# Altium schematic sheet SwitchIntegration.SchDoc
size A4; SheetNumber: 5; SheetTotal: 6
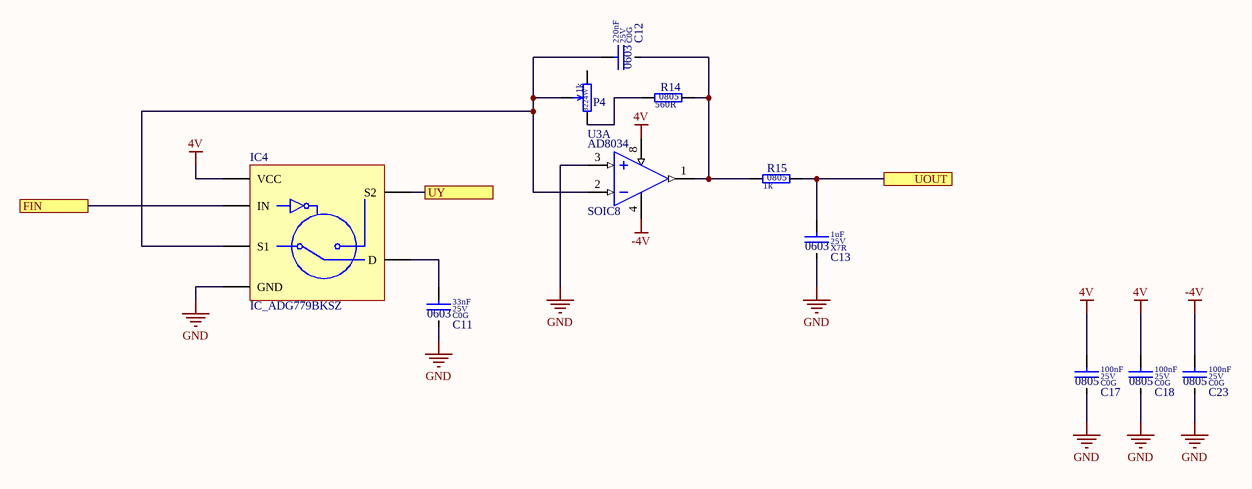
[diagram p0: SwitchIntegration.SchDoc]

## Parts
C11  value 33nF  Dielectric: C0G  Voltage: 25V  SCH_Footprint: 0603  [C_0603_1608]  (hidden comment: C_33nF_0603_C0G_25V_5)
C12  value 220nF  Dielectric: C0G  Voltage: 25V  SCH_Footprint: 0603  [C_0603_1608]  (hidden comment: C_220nF_0603_C0G_25V_5)
C13  value 1uF  Dielectric: X7R  Voltage: 25V  SCH_Footprint: 0603  [C_1206_3216]  (hidden comment: C_1uF_1206_X7R_25V_5)
C17  value 100nF  Dielectric: C0G  Voltage: 25V  SCH_Footprint: 0805  [C_0805_2012]  (hidden comment: C_100nF_0805_C0G_25V_5)
C18  value 100nF  Dielectric: C0G  Voltage: 25V  SCH_Footprint: 0805  [C_0805_2012]  (hidden comment: C_100nF_0805_C0G_25V_5)
C23  value 100nF  Dielectric: C0G  Voltage: 25V  SCH_Footprint: 0805  [C_0805_2012]  (hidden comment: C_100nF_0805_C0G_25V_5)
IC4  IC_ADG779BKSZ  [SC70]
P4  value 1k  SCH_Footprint: 3224W  [Potentiometer]  (hidden comment: POT_1k)
R14  SCH_Footprint: 0805  Resistance: 560R  [R_0805_2012]  (hidden comment: R_560R_0805_5)
R15  SCH_Footprint: 0805  Resistance: 1k  [R_0805_2012]  (hidden comment: R_1k_0805_5)
U3  value AD8034  SCH_Footprint: SOIC8  [SO8]  (hidden comment: A2_AD8034)  (part A of 2)

## Ports
FIN, UOUT, UY

## Nets
4V: C17.1 C18.1 IC4.2(VCC) U3.8(VDD)
-4V: C23.1 U3.4(GND)
GND: C11.2 C13.2 C17.2 C18.2 C23.2 IC4.3(GND) U3.3(IN+1)
FIN: IC4.1(IN) ; port FIN
UOUT: C13.1 R15.2 ; port UOUT
UY: IC4.6(S2) ; port UY
NetC11_1: C11.1 IC4.5(D)
NetC12_1: C12.1 IC4.4(S1) P4.2 U3.2(IN-1)
NetC12_2: C12.2 R14.2 R15.1 U3.1(OUT1)
NetP4_3: P4.3 R14.1

Not connected (* = marked no-connect by the designer): P4 1

## Library data of the parts
C11 = C_33nF_0603_C0G_25V_5: Capacitor
C12 = C_220nF_0603_C0G_25V_5: Capacitor
C13 = C_1uF_1206_X7R_25V_5: Capacitor
C17 C18 C23 = C_100nF_0805_C0G_25V_5: Capacitor
R14 = R_560R_0805_5: Tolerance: 5
R15 = R_1k_0805_5: Tolerance: 5